# Altium schematic sheet MLX90393SLQ.SchDoc
size A3; SheetNumber: 7; SheetTotal: 8
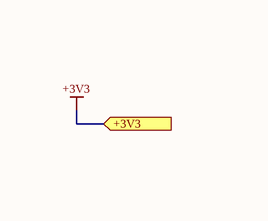
[diagram p0: MLX90393SLQ.SchDoc, top left]
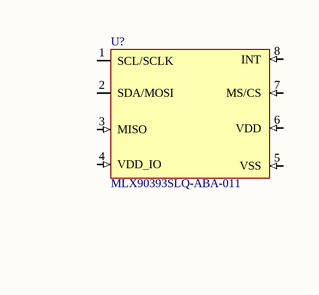
[diagram p1: MLX90393SLQ.SchDoc, top right]
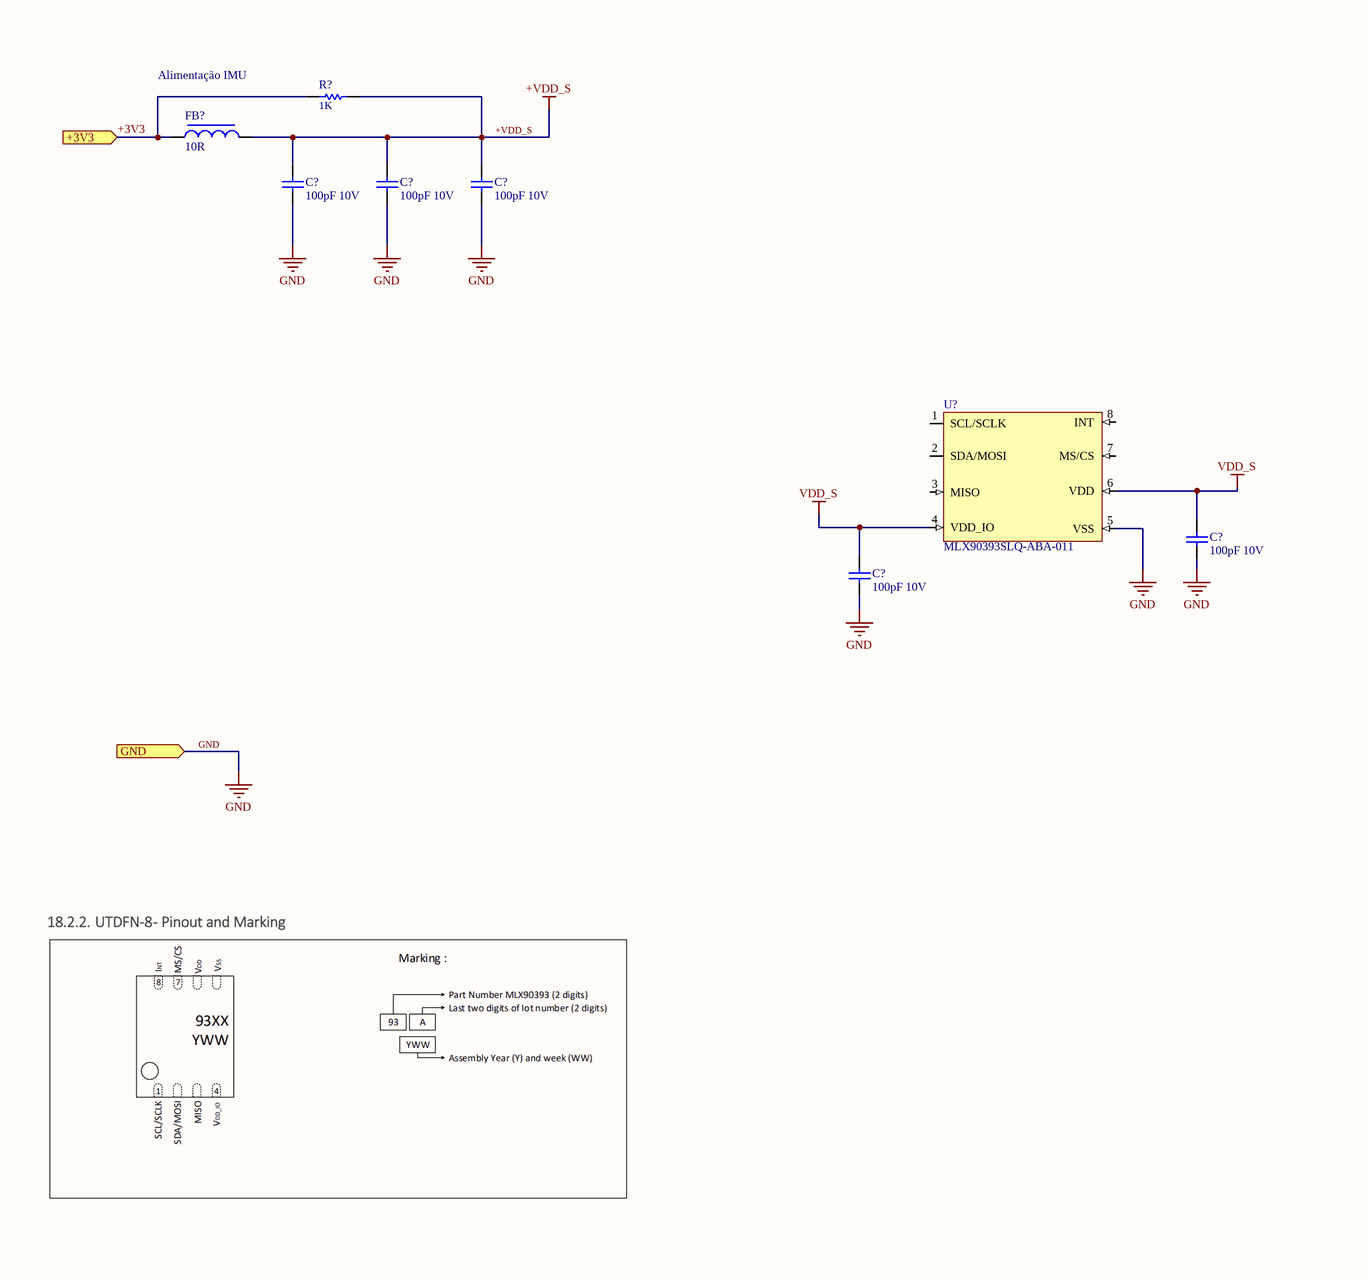
[diagram p2: MLX90393SLQ.SchDoc, bottom left]
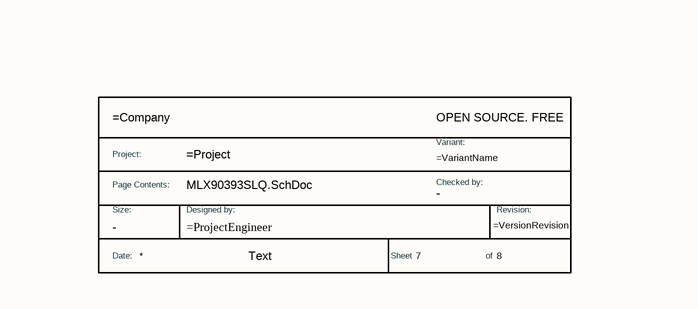
[diagram p3: MLX90393SLQ.SchDoc, bottom right]

## Parts
(Parts that share a designator on the sheet are numbered #1, #2 ... from top to bottom, then left to right.)
*  TitleBlock  (value not drawn)  (graphical)
C?#1  value 100pF 10V  (hidden comment: _Capacitor)
C?#2  value 100pF 10V  (hidden comment: _Capacitor)
C?#3  value 100pF 10V  (hidden comment: _Capacitor)
C?#4  value 100pF 10V  (hidden comment: _Capacitor)
C?#5  value 100pF 10V  (hidden comment: _Capacitor)
FB?  value 10R  (hidden comment: _FERRITE)
R?  value 1K  (hidden comment: _Resistor)
U?#1  MLX90393SLQ-ABA-011
U?#2  MLX90393SLQ-ABA-011

## Ports
+3V3 (in, see 1[6B]), GND (in, see 1[3C], 2[4A], 4[1A])

## Nets
+3V3: FB?.1 R?.1 ; port +3V3
+VDD_S: C?#1.1 C?#2.1 C?#3.1 FB?.2 R?.2
GND: C?#1.2 C?#2.2 C?#3.2 C?#4.2 C?#5.2 U?#2.5(VSS) ; port GND
VDD_S: C?#4.1 C?#5.1 U?#2.4(VDD_IO) U?#2.6(VDD)

Not connected (* = marked no-connect by the designer): U?#1 1(SCL/SCLK) 2(SDA/MOSI) 3(MISO) 4(VDD_IO) 5(VSS) 6(VDD) 7(MS/CS) 8(INT); U?#2 1(SCL/SCLK) 2(SDA/MOSI) 3(MISO) 7(MS/CS) 8(INT)

## Notes on the sheet
- Alimentação IMU
- Todas as informações e detalhes técnicos deste documento são de inteira propriedade da empresa V2COM,
- não poderão ser copiados, reduzidos ou cedidos a terceiros sem prévia autorização por escrito da mesma.
- Salvo em (D/M/A):
- Página:
- de
- Nome do Projeto:
- https://v2com.com/
- Ed.:
- Responsável:
- Nome da página:
- Rev.:
- Projetista:
- Obs.:
- Revisor:
- Arquivo:
- -
- (in symbol TitleBlock) OPEN SOURCE. FREE; Project:; Variant:; Page Contents:; Checked by:; Size:; Designed by:; Revision:; Date:; Text; Sheet; of

## Library data of the parts
* = TitleBlock: Standard Title Block; DWG NO: =ProjectEngineer; Size: -; Checked by: -
C?#1-C?#5 = _Capacitor: Capacitor; Published: 8-Jun-2000; LatestRevisionDate: 17-Jul-2002; LatestRevisionNote: Re-released for DXP Platform.; PackageReference: RAD-0.3; Publisher: Altium Limited; PackageDescription: Radial Cap, Thru-Hole; 2 Leads; 0.3 in Pin Spacing
FB? = _FERRITE: Ferrite Bead; Code_IEC: 1005; Published: 8-Jun-2000; LatestRevisionDate: 29-May-2009; LatestRevisionNote: IPC-7351 Footprint Added.; PackageReference: 0402-A; Publisher: Altium Limited; PackageDescription: Chip Inductor; Code_JEITA: 0402
R? = _Resistor: Resistor; Published: 8-Jun-2000; LatestRevisionDate: 17-Jul-2002; LatestRevisionNote: Re-released for DXP Platform.; PackageReference: AXIAL-0.3; Publisher: Altium Limited; PackageDescription: Axial Device, Thru-Hole; 2 Leads; 0.3 in Pin Spacing
U?#1 U?#2 = MLX90393SLQ-ABA-011: IC MAGNOMETER SPI/I2C 8UTDFN